# Altium project comm-rfb.PrjPcb
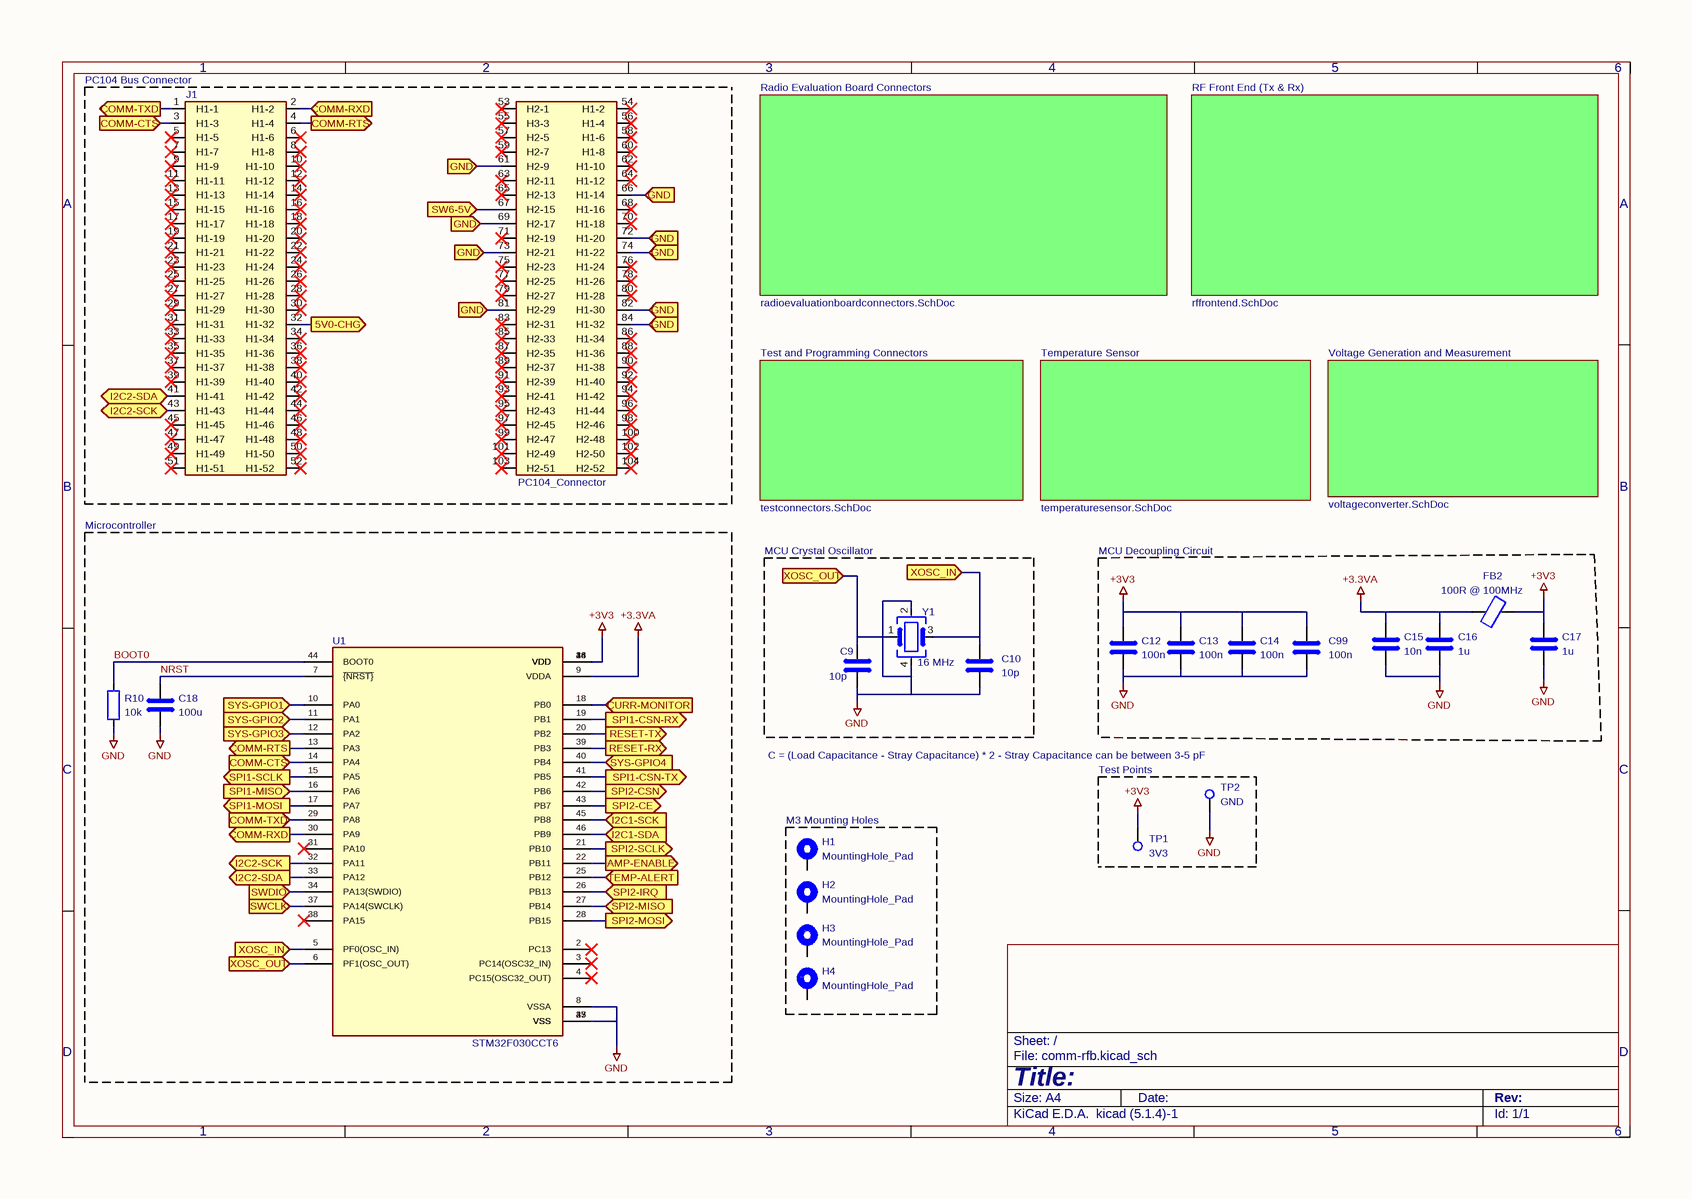
[diagram p0: comm-rfb.SchDoc]
14 sheets, 95 parts. Net scope: flat (ports and power ports of the same name join across sheets).
Board files: comm-rfb.PcbDoc, comm-rfb(1).PcbDoc
Sheets:
  comm-rfb.SchDoc
    Test and Programming Connectors = testconnectors.SchDoc
    RF Front End (Tx & Rx) = rffrontend.SchDoc
    Radio Evaluation Board Connectors = radioevaluationboardconnectors.SchDoc
    Voltage Generation and Measurement = voltageconverter.SchDoc
    Temperature Sensor = temperaturesensor.SchDoc
  currentandvoltagemeasure.SchDoc
  downlinkSMDConnector.SchDoc
  powerAMP.SchDoc
  programminginterface.SchDoc
  radiotestconnector.SchDoc
  SMAconnections.SchDoc
  systemtestconnector.SchDoc
  uplinkSMDConnector.SchDoc

## Sheet comm-rfb.SchDoc
size 297 x 209 mm

### Parts
(Parts that share a designator on the sheet are numbered #1, #2 ... from top to bottom, then left to right.)
C9  10p  [C_0603_1608Metric]
C10  10p  [C_0603_1608Metric]
C12  100n  [C_0603_1608Metric]
C13  100n  [C_0603_1608Metric]
C14  100n  [C_0603_1608Metric]
C15  10n  [C_0603_1608Metric]
C16  1u  [C_0603_1608Metric]
C17  1u  [C_0603_1608Metric]
C18  100u  [C_0603_1608Metric]
C99  100n  [C_0603_1608Metric]
FB2  100R @ 100MHz  [L_0603_1608Metric]
H1  MountingHole_Pad  [MountingHole_3.2mm_M3_Pad_TopBottom]
H2  MountingHole_Pad  [MountingHole_3.2mm_M3_Pad_TopBottom]
H3  MountingHole_Pad  [MountingHole_3.2mm_M3_Pad_TopBottom]
H4  MountingHole_Pad  [MountingHole_3.2mm_M3_Pad_TopBottom]
J1  PC104_Connector  [pc104-connector]
R10  10k  [R_0603_1608Metric]
TP1#1  3V3  [TestPoint_Pad_D2.0mm]
TP2  GND  [TestPoint_Pad_D2.0mm]
U1  STM32F030CCT6  [QFP50P900X900X160-48N]
Y1  16 MHz  [Crystal_SMD_3225-4Pin_3.2x2.5mm]

### Blocks framed on the sheet
PC104 Bus Connector: J1
Microcontroller: C18 R10 U1
MCU Crystal Oscillator: C9 C10 Y1
Test Points: TP1#1 TP2
M3 Mounting Holes /: H1-H4

### Sub-sheets
Radio Evaluation Board Connectors = radioevaluationboardconnectors.SchDoc: no entries
RF Front End (Tx & Rx) = rffrontend.SchDoc: no entries
Temperature Sensor = temperaturesensor.SchDoc: no entries
Test and Programming Connectors = testconnectors.SchDoc: no entries
Voltage Generation and Measurement = voltageconverter.SchDoc: no entries

### Ports
5V0-CHG (out), AMP-ENABLE (out), COMM-CTS (in), COMM-RTS (out), COMM-RXD (in), COMM-RXD (out), COMM-TXD (in), COMM-TXD (out), CURR-MONITOR (in), GND (in), I2C1-SCK (in), I2C1-SDA (in), I2C2-SCK (bidir), I2C2-SCK (out), I2C2-SDA (bidir), I2C2-SDA (out), RESET-RX (out), RESET-TX (out), SPI1-CSN-RX (out), SPI1-CSN-TX (out), SPI1-MISO (in), SPI1-MOSI (out), SPI1-SCLK (out), SPI2-CE (out), SPI2-CSN (out), SPI2-IRQ (in), SPI2-MISO (in), SPI2-MOSI (out), SPI2-SCLK (out), SW6-5V (in), SWCLK (in), SWDIO (in), SYS-GPIO1 (in), SYS-GPIO2 (in), SYS-GPIO3 (in), SYS-GPIO4 (in), TEMP-ALERT (in), XOSC_IN (in), XOSC_OUT (in)

### Nets
+3.3VA: C15.1 C16.1 FB2.1 U1.9(VDDA)
+3V3: C12.1 C13.1 C14.1 C17.1 C99.1 FB2.2 TP1#1.1 U1.1(VDD) U1.24(VDD) U1.36(VDD) U1.48(VDD)
GND: C9.2 C10.2 C12.2 C13.2 C14.2 C15.2 C16.2 C17.2 C18.2 C99.2 R10.2 TP2.1 U1.8(VSSA) U1.23(VSS) U1.35(VSS) U1.47(VSS) Y1.2 Y1.4
5V0-CHG: J1.32(H1-32) ; port 5V0-CHG
AMP-ENABLE: U1.22(PB11) ; port AMP-ENABLE
BOOT0: R10.1 U1.44(BOOT0)
COMM-CTS: J1.3(H1-3) U1.14(PA4) ; port COMM-CTS
COMM-RTS: J1.4(H1-4) U1.13(PA3) ; port COMM-RTS
COMM-RXD: J1.2(H1-2) U1.30(PA9) ; port COMM-RXD
COMM-TXD: J1.1(H1-1) U1.29(PA8) ; port COMM-TXD
CURR-MONITOR: U1.18(PB0) ; port CURR-MONITOR
GND: J1.61(H2-9) J1.66(H1-14) J1.69(H2-17) J1.72(H1-20) J1.73(H2-21) J1.74(H1-22) J1.81(H2-29) J1.82(H1-30) J1.84(H1-32) ; port GND  [a separate net that carries the same name]
I2C1-SCK: U1.45(PB8) ; port I2C1-SCK
I2C1-SDA: U1.46(PB9) ; port I2C1-SDA
I2C2-SCK: J1.43(H1-43) U1.32(PA11) ; port I2C2-SCK
I2C2-SDA: J1.41(H1-41) U1.33(PA12) ; port I2C2-SDA
NRST: C18.1 U1.7(~{{NRST}})
RESET-RX: U1.39(PB3) ; port RESET-RX
RESET-TX: U1.20(PB2) ; port RESET-TX
SPI1-CSN-RX: U1.19(PB1) ; port SPI1-CSN-RX
SPI1-CSN-TX: U1.41(PB5) ; port SPI1-CSN-TX
SPI1-MISO: U1.16(PA6) ; port SPI1-MISO
SPI1-MOSI: U1.17(PA7) ; port SPI1-MOSI
SPI1-SCLK: U1.15(PA5) ; port SPI1-SCLK
SPI2-CE: U1.43(PB7) ; port SPI2-CE
SPI2-CSN: U1.42(PB6) ; port SPI2-CSN
SPI2-IRQ: U1.26(PB13) ; port SPI2-IRQ
SPI2-MISO: U1.27(PB14) ; port SPI2-MISO
SPI2-MOSI: U1.28(PB15) ; port SPI2-MOSI
SPI2-SCLK: U1.21(PB10) ; port SPI2-SCLK
SW6-5V: J1.67(H2-15) ; port SW6-5V
SWCLK: U1.37(PA14(SWCLK)) ; port SWCLK
SWDIO: U1.34(PA13(SWDIO)) ; port SWDIO
SYS-GPIO1: U1.10(PA0) ; port SYS-GPIO1
SYS-GPIO2: U1.11(PA1) ; port SYS-GPIO2
SYS-GPIO3: U1.12(PA2) ; port SYS-GPIO3
SYS-GPIO4: U1.40(PB4) ; port SYS-GPIO4
TEMP-ALERT: U1.25(PB12) ; port TEMP-ALERT
XOSC_IN: C10.1 U1.5(PF0(OSC_IN)) Y1.3 ; port XOSC_IN
XOSC_OUT: C9.1 U1.6(PF1(OSC_OUT)) Y1.1 ; port XOSC_OUT

Not connected (* = marked no-connect by the designer): H1 1; H2 1; H3 1; H4 1; J1 5(H1-5)* 6(H1-6)* 7(H1-7)* 8(H1-8)* 9(H1-9)* 10(H1-10)* 11(H1-11)* 12(H1-12)* 13(H1-13)* 14(H1-14)* 15(H1-15)* 16(H1-16)* 17(H1-17)* 18(H1-18)* 19(H1-19)* 20(H1-20)* 21(H1-21)* 22(H1-22)* 23(H1-23)* 24(H1-24)* 25(H1-25)* 26(H1-26)* 27(H1-27)* 28(H1-28)* 29(H1-29)* 30(H1-30)* 31(H1-31)* 33(H1-33)* 34(H1-34)* 35(H1-35)* 36(H1-36)* 37(H1-37)* 38(H1-38)* 39(H1-39)* 40(H1-40)* 42(H1-42)* 44(H1-44)* 45(H1-45)* 46(H1-46)* 47(H1-47)* 48(H1-48)* 49(H1-49)* 50(H1-50)* 51(H1-51)* 52(H1-52)* 53(H2-1)* 54(H1-2)* 55(H3-3)* 56(H1-4)* 57(H2-5)* 58(H1-6)* 59(H2-7)* 60(H1-8)* 62(H1-10)* 63(H2-11)* 64(H1-12)* 65(H2-13)* 68(H1-16)* 70(H1-18)* 71(H2-19)* 75(H2-23)* 76(H1-24)* 77(H2-25)* 78(H1-26)* 79(H2-27)* 80(H1-28)* 83(H2-31)* 85(H2-33)* 86(H1-34)* 87(H2-35)* 88(H1-36)* 89(H2-37)* 90(H1-38)* 91(H2-39)* 92(H1-40)* 93(H2-41)* 94(H1-42)* 95(H2-43)* 96(H1-44)* 97(H2-45)* 98(H2-46)* 99(H2-47)* 100(H2-48)* 101(H2-49)* 102(H2-50)* 103(H2-51)* 104(H2-52)*; U1 2(PC13)* 3(PC14(OSC32_IN))* 4(PC15(OSC32_OUT))* 31(PA10)* 38(PA15)*

### Notes on the sheet
- MCU Decoupling Circuit
- (near TP2) C = (Load Capacitance - Stray Capacitance) * 2
  - Stray Capacitance can be between 3-5 pF
- 1
- 2
- 3
- 4
- 5
- 6
- A
- B
- C
- D
- Title:
- File: comm-rfb.kicad_sch
- Sheet: /
- KiCad E.D.A.  kicad (5.1.4)-1
- Size: A4
- Date:
- Rev:
- Id: 1/1

### Library data of the parts
C9 C10 C12-C18 C99 = C: Footprint: Capacitor_SMD:C_0603_1608Metric
  C9 C10: Value: 10p
  C12-C14 C99: Value: 100n
  C15: Value: 10n
  C16 C17: Value: 1u
  C18: Value: 100u
FB2 = FerriteBead: Value: 100R @ 100MHz; Footprint: Inductor_SMD:L_0603_1608Metric
R10 = R: Value: 10k; Footprint: Resistor_SMD:R_0603_1608Metric
TP1#1 TP2 = TestPoint: Footprint: TestPoint:TestPoint_Pad_D2.0mm
  TP1#1: Value: 3V3
  TP2: Value: GND
U1 = STM32F030CCT6: MANUFACTURER: STMicroelectronics; Value: STM32F030CCT6; Footprint: qset-footprints:QFP50P900X900X160-48N
Y1 = Crystal_GND24: Value: 16 MHz; Footprint: Crystal:Crystal_SMD_3225-4Pin_3.2x2.5mm
H1-H4 = MountingHole_Pad: Value: MountingHole_Pad; Footprint: MountingHole:MountingHole_3.2mm_M3_Pad_TopBottom
J1 = PC104_Connector: Value: PC104_Connector; Footprint: pc104-template:pc104-connector

## Sheet testconnectors.SchDoc
size 297 x 209 mm
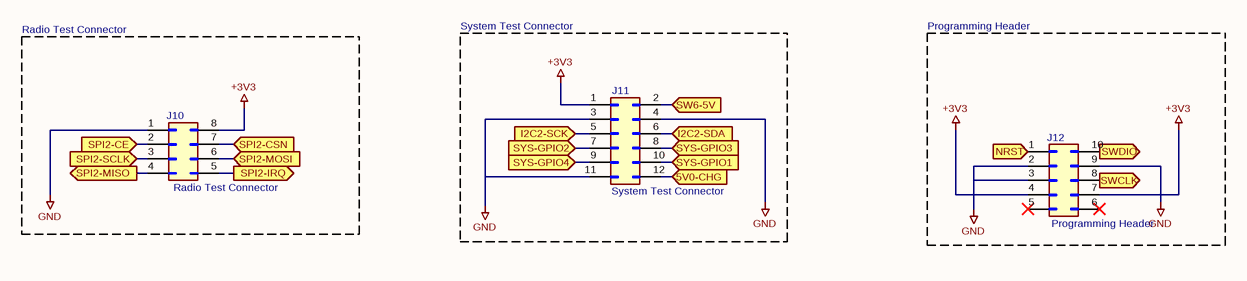
[diagram p1: testconnectors.SchDoc]

### Parts
(Parts that share a designator on the sheet are numbered #1, #2 ... from top to bottom, then left to right.)
J10#1  Radio Test Connector  [PinSocket_2x04_P2.54mm_Vertical]
J11#1  System Test Connector  [PinSocket_2x06_P2.54mm_Horizontal]
J12#1  Programming Header  [PinSocket_2x05_P2.54mm_Horizontal]

### Blocks framed on the sheet
Radio Test Connector: J10#1
System Test Connector: J11#1
Programming Header: J12#1

### Ports
5V0-CHG (in), I2C2-SCK (in), I2C2-SDA (in), NRST (in), SPI2-CE (in), SPI2-CSN (in), SPI2-IRQ (out), SPI2-MISO (out), SPI2-MOSI (in), SPI2-SCLK (in), SW6-5V (in), SWCLK (in), SWDIO (in), SYS-GPIO1 (in), SYS-GPIO2 (in), SYS-GPIO3 (in), SYS-GPIO4 (in)

### Nets
+3V3: J10#1.8(Pin_8) J11#1.1(Pin_1) J12#1.4(Pin_4) J12#1.7(Pin_7)
GND: J10#1.1(Pin_1) J11#1.3(Pin_3) J11#1.4(Pin_4) J11#1.11(Pin_11) J12#1.2(Pin_2) J12#1.3(Pin_3) J12#1.9(Pin_9)
5V0-CHG: J11#1.12(Pin_12) ; port 5V0-CHG
I2C2-SCK: J11#1.5(Pin_5) ; port I2C2-SCK
I2C2-SDA: J11#1.6(Pin_6) ; port I2C2-SDA
NRST: J12#1.1(Pin_1) ; port NRST
SPI2-CE: J10#1.2(Pin_2) ; port SPI2-CE
SPI2-CSN: J10#1.7(Pin_7) ; port SPI2-CSN
SPI2-IRQ: J10#1.5(Pin_5) ; port SPI2-IRQ
SPI2-MISO: J10#1.4(Pin_4) ; port SPI2-MISO
SPI2-MOSI: J10#1.6(Pin_6) ; port SPI2-MOSI
SPI2-SCLK: J10#1.3(Pin_3) ; port SPI2-SCLK
SW6-5V: J11#1.2(Pin_2) ; port SW6-5V
SWCLK: J12#1.8(Pin_8) ; port SWCLK
SWDIO: J12#1.10(Pin_10) ; port SWDIO
SYS-GPIO1: J11#1.10(Pin_10) ; port SYS-GPIO1
SYS-GPIO2: J11#1.7(Pin_7) ; port SYS-GPIO2
SYS-GPIO3: J11#1.8(Pin_8) ; port SYS-GPIO3
SYS-GPIO4: J11#1.9(Pin_9) ; port SYS-GPIO4

Not connected (* = marked no-connect by the designer): J12#1 5(Pin_5)* 6(Pin_6)*

### Notes on the sheet
- 1
- 2
- 3
- 4
- 5
- 6
- A
- B
- C
- D
- Title:
- File: testconnectors.kicad_sch
- Sheet: /
- KiCad E.D.A.  kicad (5.1.4)-1
- Size: A4
- Date:
- Rev:
- Id: 1/1

### Library data of the parts
J10#1 = Conn_02x04_Counter_Clockwise: Value: Radio Test Connector; Footprint: Connector_PinSocket_2.54mm:PinSocket_2x04_P2.54mm_Vertical
J11#1 = Conn_02x06_Odd_Even: Value: System Test Connector; Footprint: Connector_PinSocket_2.54mm:PinSocket_2x06_P2.54mm_Horizontal
J12#1 = Conn_02x05_Counter_Clockwise: Value: Programming Header; Footprint: Connector_PinSocket_2.54mm:PinSocket_2x05_P2.54mm_Horizontal

## Sheet rffrontend.SchDoc
size 297 x 209 mm
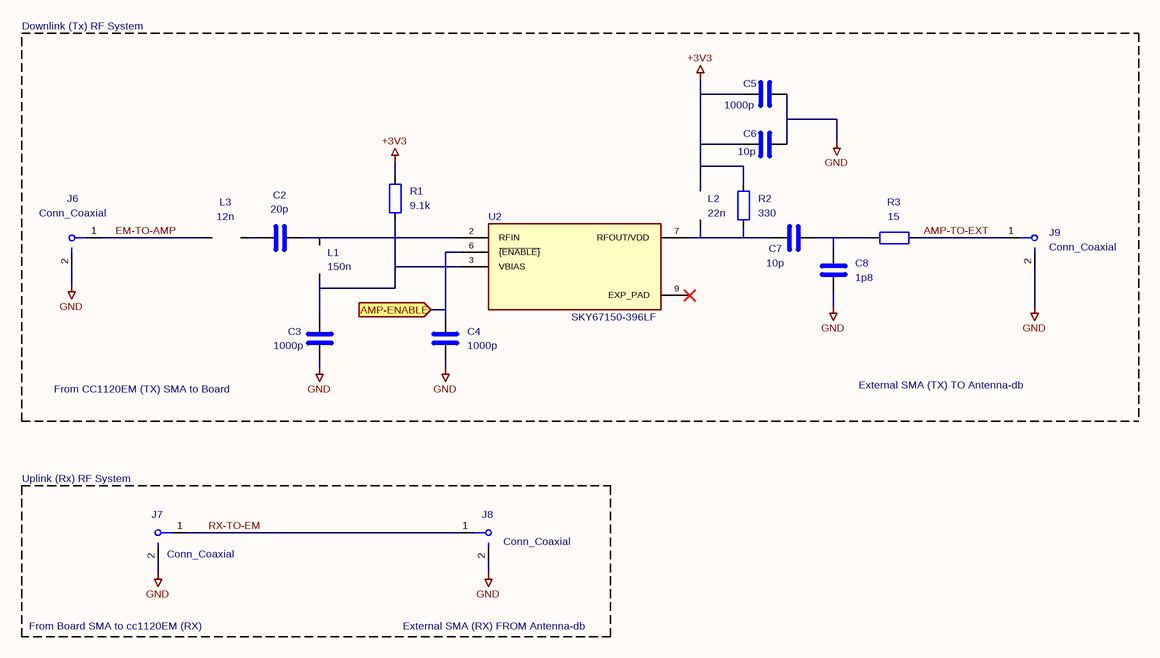
[diagram p2: rffrontend.SchDoc]

### Parts
(Parts that share a designator on the sheet are numbered #1, #2 ... from top to bottom, then left to right.)
C2#1  20p  [C_0402_1005Metric]
C3#1  1000p  [C_0402_1005Metric]
C4#1  1000p  [C_0402_1005Metric]
C5#1  1000p  [C_0402_1005Metric]
C6#1  10p  [C_0402_1005Metric]
C7#1  10p  [C_0402_1005Metric]
C8#1  1p8  [C_0402_1005Metric]
J6#1  Conn_Coaxial  [U.FL_Hirose_U.FL-R-SMT-1_Vertical]
J7#1  Conn_Coaxial  [U.FL_Hirose_U.FL-R-SMT-1_Vertical]
J8#1  Conn_Coaxial  [SMA_Amphenol_132134-11_Vertical]
J9#1  Conn_Coaxial  [SMA_Amphenol_132134-11_Vertical]
L1#1  150n  [L_0402_1005Metric]
L2#1  22n  [L_0402_1005Metric]
L3  12n  [L_0402_1005Metric]
R1#1  9.1k  [R_0603_1608Metric]
R2#1  330  [R_0402_1005Metric]
R3#1  15  [R_0402_1005Metric]
U2#1  SKY67150-396LF  [SON50P200X200X80-9N]

### Ports
AMP-ENABLE (in)

### Nets
+3V3: C5#1.1 C6#1.1 L2#1.1 R1#1.1 R2#1.1
GND: C3#1.2 C4#1.2 C5#1.2 C6#1.2 C8#1.2 J6#1.2(Ext) J7#1.2(Ext) J8#1.2(Ext) J9#1.2(Ext)
AMP-ENABLE: C4#1.1 U2#1.6(~{{ENABLE}}) ; port AMP-ENABLE
AMP-TO-EXT: J9#1.1(In) R3#1.2
EM-TO-AMP: J6#1.1(In) L3.1
RX-TO-EM: J7#1.1(In) J8#1.1(In)
NetC2#1_1: C2#1.1 L3.2
NetC2#1_2: C2#1.2 L1#1.1 U2#1.2(RFIN)
NetC3#1_1: C3#1.1 L1#1.2 R1#1.2 U2#1.3(VBIAS)
NetC7#1_1: C7#1.1 L2#1.2 R2#1.2 U2#1.7(RFOUT/VDD)
NetC7#1_2: C7#1.2 C8#1.1 R3#1.1

Not connected (* = marked no-connect by the designer): U2#1 9(EXP_PAD)*

### Notes on the sheet
- Downlink (Tx) RF System
- From CC1120EM (TX) SMA to Board
- External SMA (TX) TO Antenna-db
- (near J7#1) Uplink (Rx) RF System
- From Board SMA to cc1120EM (RX)
- External SMA (RX) FROM Antenna-db
- 1
- 2
- 3
- 4
- 5
- 6
- A
- B
- C
- D
- Title:
- File: rffrontend.kicad_sch
- Sheet: /
- KiCad E.D.A.  kicad (5.1.4)-1
- Size: A4
- Date:
- Rev:
- Id: 1/1

### Library data of the parts
C2#1 C3#1 C4#1 C5#1 C6#1 C7#1 C8#1 = C: Footprint: Capacitor_SMD:C_0402_1005Metric
  C2#1: Value: 20p
  C3#1 C4#1 C5#1: Value: 1000p
  C6#1 C7#1: Value: 10p
  C8#1: Value: 1p8
L1#1 L2#1 L3 = L: Footprint: Inductor_SMD:L_0402_1005Metric
  L1#1: Value: 150n
  L2#1: Value: 22n
  L3: Value: 12n
R1#1 R2#1 R3#1 = R
  R1#1: Value: 9.1k; Footprint: Resistor_SMD:R_0603_1608Metric
  R2#1: Value: 330; Footprint: Resistor_SMD:R_0402_1005Metric
  R3#1: Value: 15; Footprint: Resistor_SMD:R_0402_1005Metric
U2#1 = SKY67150-396LF: MANUFACTURER: Skyworks; SNAPEDA_PACKAE_ID: 8744; STANDARD: IPC-7351B; PARTREV: May 3,2017; Value: SKY67150-396LF
J6#1 J7#1 J8#1 J9#1 = Conn_Coaxial: Value: Conn_Coaxial
  J6#1 J7#1: Footprint: Connector_Coaxial:U.FL_Hirose_U.FL-R-SMT-1_Vertical
  J8#1 J9#1: Footprint: Connector_Coaxial:SMA_Amphenol_132134-11_Vertical

## Sheet radioevaluationboardconnectors.SchDoc
size 297 x 209 mm
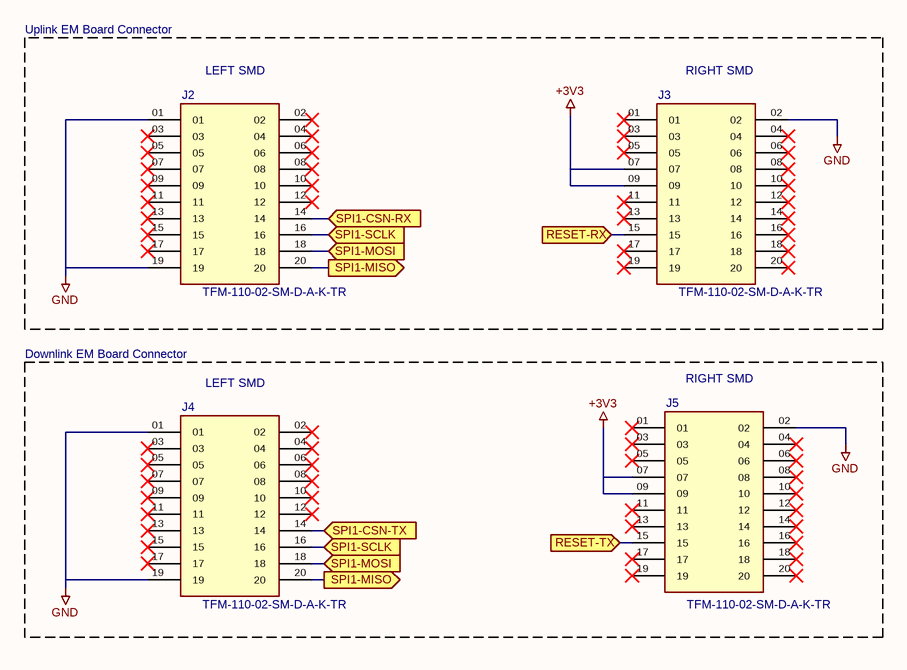
[diagram p3: radioevaluationboardconnectors.SchDoc]

### Parts
(Parts that share a designator on the sheet are numbered #1, #2 ... from top to bottom, then left to right.)
J2#1  TFM-110-02-SM-D-A-K-TR  [SAMTEC_TFM-110-02-SM-D-A-K-TR]
J3#1  TFM-110-02-SM-D-A-K-TR  [SAMTEC_TFM-110-02-SM-D-A-K-TR]
J4#1  TFM-110-02-SM-D-A-K-TR  [SAMTEC_TFM-110-02-SM-D-A-K-TR]
J5#1  TFM-110-02-SM-D-A-K-TR  [SAMTEC_TFM-110-02-SM-D-A-K-TR]

### Ports
RESET-RX (in), RESET-TX (in), SPI1-CSN-RX (in), SPI1-CSN-TX (in), SPI1-MISO (out), SPI1-MOSI (in), SPI1-SCLK (in)

### Nets
+3V3: J3#1.07 J3#1.09 J5#1.07 J5#1.09
GND: J2#1.01 J2#1.19 J3#1.02 J4#1.01 J4#1.19 J5#1.02
RESET-RX: J3#1.15 ; port RESET-RX
RESET-TX: J5#1.15 ; port RESET-TX
SPI1-CSN-RX: J2#1.14 ; port SPI1-CSN-RX
SPI1-CSN-TX: J4#1.14 ; port SPI1-CSN-TX
SPI1-MISO: J2#1.20 J4#1.20 ; port SPI1-MISO
SPI1-MOSI: J2#1.18 J4#1.18 ; port SPI1-MOSI
SPI1-SCLK: J2#1.16 J4#1.16 ; port SPI1-SCLK

Not connected (* = marked no-connect by the designer): J2#1 02* 03* 04* 05* 06* 07* 08* 09* 10* 11* 12* 13* 15* 17*; J3#1 01* 03* 04* 05* 06* 08* 10* 11* 12* 13* 14* 16* 17* 18* 19* 20*; J4#1 02* 03* 04* 05* 06* 07* 08* 09* 10* 11* 12* 13* 15* 17*; J5#1 01* 03* 04* 05* 06* 08* 10* 11* 12* 13* 14* 16* 17* 18* 19* 20*

### Notes on the sheet
- Uplink EM Board Connector
- (near J2#1) LEFT SMD
- (near J3#1) RIGHT SMD
- Downlink EM Board Connector
- (near J4#1) LEFT SMD
- (near J5#1) RIGHT SMD
- 1
- 2
- 3
- 4
- 5
- 6
- A
- B
- C
- D
- Title:
- File: radioevaluationboardconnectors.kicad_sch
- Sheet: /
- KiCad E.D.A.  kicad (5.1.4)-1
- Size: A4
- Date:
- Rev:
- Id: 1/1

### Library data of the parts
J2#1 J3#1 J4#1 J5#1 = TFM-110-02-SM-D-A-K-TR: MANUFACTURER: Samtec; STANDARD: Manufacturer Recommendations; PARTREV: R; Value: TFM-110-02-SM-D-A-K-TR

## Sheet voltageconverter.SchDoc
size 297 x 209 mm
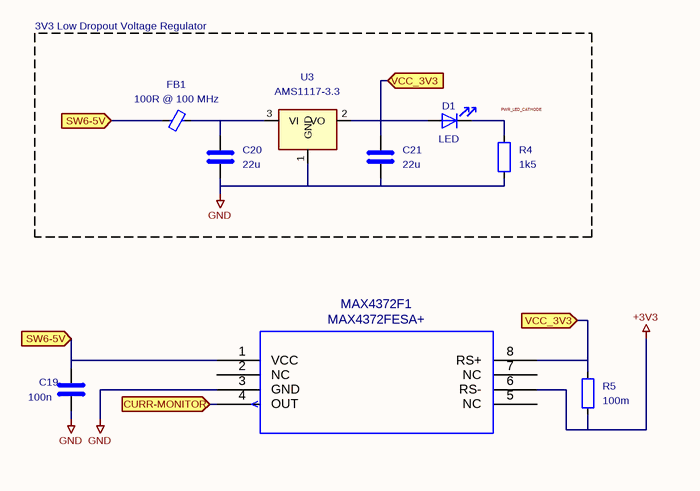
[diagram p4: voltageconverter.SchDoc]

### Parts
(Parts that share a designator on the sheet are numbered #1, #2 ... from top to bottom, then left to right.)
C19  100n  [C_0603_1608Metric]
C20  22u  [C_0603_1608Metric]
C21  22u  [C_0603_1608Metric]
D1  LED  [LED_0603_1608Metric]
FB1  100R @ 100 MHz  [L_0603_1608Metric]
MAX4372F1#1  MAX4372FESA+  [SOIC127P600X175-8N]
R4  1k5  [R_0603_1608Metric]
R5  100m  [R_0402_1005Metric]
U3  AMS1117-3.3  [SOT-223-3_TabPin2]

### Ports
CURR-MONITOR (in), SW6-5V (in), VCC_3V3 (in)

### Nets
+3V3: MAX4372F1#1.6(RS-) R5.2
GND: C19.2 C20.2 C21.2 MAX4372F1#1.3(GND) R4.1 U3.1(GND)
CURR-MONITOR: MAX4372F1#1.4(OUT) ; port CURR-MONITOR
SW6-5V: C19.1 FB1.2 MAX4372F1#1.1(VCC) ; port SW6-5V
VCC_3V3: C21.1 D1.2(A) MAX4372F1#1.8(RS+) R5.1 U3.2(VO) ; port VCC_3V3
NetC20_1: C20.1 FB1.1 U3.3(VI)
NetD1_1: D1.1(K) R4.2

Not connected (* = marked no-connect by the designer): MAX4372F1#1 2(NC) 5(NC) 7(NC)

### Notes on the sheet
- 3V3 Low Dropout Voltage Regulator
- Labels drawn without touching a wire or pin: PWR_LED_CATHODE
- 1
- 2
- 3
- 4
- 5
- 6
- A
- B
- C
- D
- Title:
- File: voltageconverter.kicad_sch
- Sheet: /
- KiCad E.D.A.  kicad (5.1.4)-1
- Size: A4
- Date:
- Rev:
- Id: 1/1

### Library data of the parts
C19-C21 = C: Footprint: Capacitor_SMD:C_0603_1608Metric
  C19: Value: 100n
  C20 C21: Value: 22u
FB1 = FerriteBead_Small: Value: 100R @ 100 MHz; Footprint: Inductor_SMD:L_0603_1608Metric
MAX4372F1#1 = MAX4372FESA+-MAX4372FESA+: Value: MAX4372FESA+; Footprint: STM32_Breakout:SOIC127P600X175-8N
R4 R5 = R
  R4: Value: 1k5; Footprint: Resistor_SMD:R_0603_1608Metric
  R5: Value: 100m; Footprint: Resistor_SMD:R_0402_1005Metric
D1 = LED: Value: LED; Footprint: LED_SMD:LED_0603_1608Metric
U3 = AMS1117-3.3: Value: AMS1117-3.3; Footprint: Package_TO_SOT_SMD:SOT-223-3_TabPin2

## Sheet temperaturesensor.SchDoc
size 297 x 209 mm
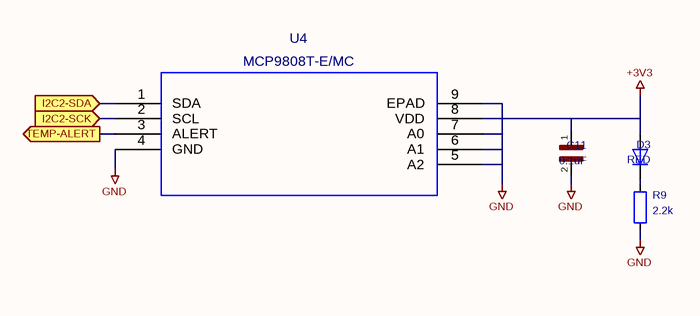
[diagram p5: temperaturesensor.SchDoc]

### Parts
C11  0.1uF  [C_0603_1608Metric]
D3  RED  [D_0603_1608Metric]
R9  2.2k  [R_0603_1608Metric]
U4  MCP9808T-E/MC  [MCP9808T-E&slash_MC]

### Ports
I2C2-SCK (in), I2C2-SDA (in), TEMP-ALERT (out)

### Nets
+3V3: C11.1 D3.1(A) U4.8(VDD)
GND: C11.2 R9.2 U4.4(GND) U4.5(A2) U4.6(A1) U4.7(A0) U4.9(EPAD)
I2C2-SCK: U4.2(SCL) ; port I2C2-SCK
I2C2-SDA: U4.1(SDA) ; port I2C2-SDA
TEMP-ALERT: U4.3(ALERT) ; port TEMP-ALERT
NetD3_2: D3.2(K) R9.1

### Notes on the sheet
- 1
- 2
- 3
- 4
- 5
- 6
- A
- B
- C
- D
- Title:
- File: temperaturesensor.kicad_sch
- Sheet: /
- KiCad E.D.A.  kicad (5.1.4)-1
- Size: A4
- Date:
- Rev:
- Id: 1/1

### Library data of the parts
C11 = CL10B104KB8NNNL: Value: 0.1uF; Footprint: Capacitor_SMD:C_0603_1608Metric
D3 = DIODE: Spice_Netlist_Enabled: Y; Spice_Primitive: D; Value: RED; Footprint: Diode_SMD:D_0603_1608Metric
R9 = R: Value: 2.2k; Footprint: Resistor_SMD:R_0603_1608Metric
U4 = MCP9808T-E{slash}MC: Value: MCP9808T-E/MC; Footprint: qset-footprints:MCP9808T-E&slash_MC

## Sheet currentandvoltagemeasure.SchDoc
size 297 x 209 mm
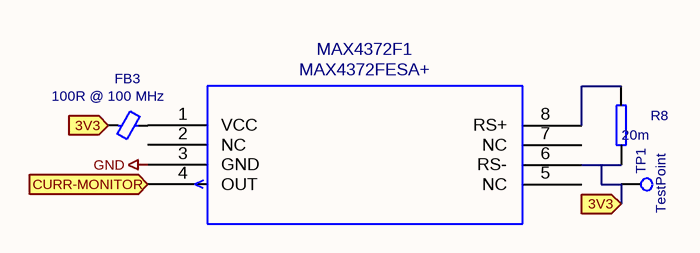
[diagram p6: currentandvoltagemeasure.SchDoc]

### Parts
(Parts that share a designator on the sheet are numbered #1, #2 ... from top to bottom, then left to right.)
FB3  100R @ 100 MHz  [INDUC1607X60N]
MAX4372F1#2  MAX4372FESA+  [SOIC127P600X175-8N]
R8  20m  [RESC1607X60N]
TP1#2  TestPoint  [TestPoint_Pad_D2.0mm]

### Ports
3V3 (in), CURR-MONITOR (in)

### Nets
GND: MAX4372F1#2.3(GND)
3V3: FB3.2 MAX4372F1#2.6(RS-) R8.2 TP1#2.1 ; port 3V3
CURR-MONITOR: MAX4372F1#2.4(OUT) ; port CURR-MONITOR
NetFB3_1: FB3.1 MAX4372F1#2.1(VCC)
NetMAX4372F1#2_8: MAX4372F1#2.8(RS+) R8.1

Not connected (* = marked no-connect by the designer): MAX4372F1#2 2(NC) 5(NC) 7(NC)

### Notes on the sheet
- 1
- 2
- 3
- 4
- 5
- 6
- A
- B
- C
- D
- Title:
- File: currentandvoltagemeasure.kicad_sch
- Sheet: /
- KiCad E.D.A.  kicad (5.1.4)-1
- Size: A4
- Date:
- Rev:
- Id: 1/1

### Library data of the parts
FB3 = Ferrite_Bead_Small: Value: 100R @ 100 MHz; Footprint: STM32_Breakout:INDUC1607X60N
MAX4372F1#2 = MAX4372FESA+-MAX4372FESA+: Value: MAX4372FESA+; Footprint: STM32_Breakout:SOIC127P600X175-8N
R8 = R0603-OBC_Libary: Value: 20m
TP1#2 = TestPoint: Value: TestPoint; Footprint: TestPoint:TestPoint_Pad_D2.0mm

## Sheet downlinkSMDConnector.SchDoc
size 297 x 209 mm
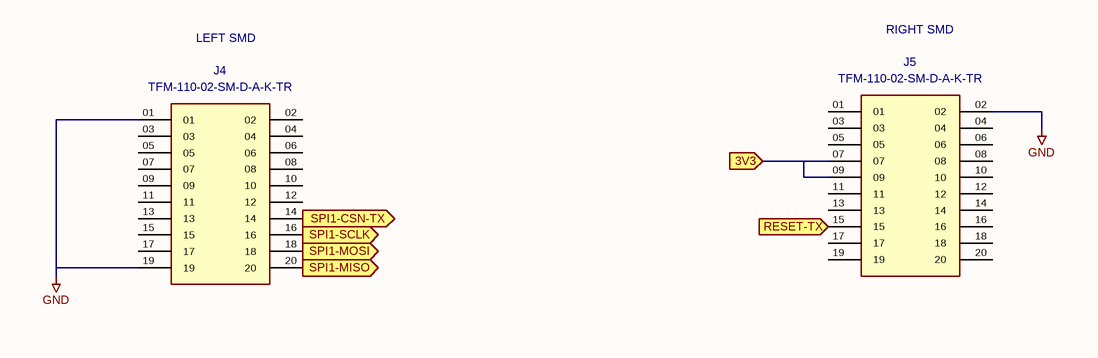
[diagram p7: downlinkSMDConnector.SchDoc]

### Parts
(Parts that share a designator on the sheet are numbered #1, #2 ... from top to bottom, then left to right.)
J4#2  TFM-110-02-SM-D-A-K-TR  [SAMTEC_TFM-110-02-SM-D-A-K-TR]
J5#2  TFM-110-02-SM-D-A-K-TR  [SAMTEC_TFM-110-02-SM-D-A-K-TR]

### Ports
3V3 (in), RESET-TX (in), SPI1-CSN-TX (in), SPI1-MISO (out), SPI1-MOSI (in), SPI1-SCLK (in)

### Nets
GND: J4#2.01 J4#2.19 J5#2.02
3V3: J5#2.07 J5#2.09 ; port 3V3
RESET-TX: J5#2.15 ; port RESET-TX
SPI1-CSN-TX: J4#2.14 ; port SPI1-CSN-TX
SPI1-MISO: J4#2.20 ; port SPI1-MISO
SPI1-MOSI: J4#2.18 ; port SPI1-MOSI
SPI1-SCLK: J4#2.16 ; port SPI1-SCLK

Not connected (* = marked no-connect by the designer): J4#2 02 03 04 05 06 07 08 09 10 11 12 13 15 17; J5#2 01 03 04 05 06 08 10 11 12 13 14 16 17 18 19 20

### Notes on the sheet
- LEFT SMD
- RIGHT SMD
- 1
- 2
- 3
- 4
- 5
- 6
- A
- B
- C
- D
- Title:
- File: downlinkSMDConnector.kicad_sch
- Sheet: /
- KiCad E.D.A.  kicad (5.1.4)-1
- Size: A4
- Date:
- Rev:
- Id: 1/1

### Library data of the parts
J4#2 J5#2 = TFM-110-02-SM-D-A-K-TR: MANUFACTURER: Samtec; STANDARD: Manufacturer Recommendations; PARTREV: R; Value: TFM-110-02-SM-D-A-K-TR

## Sheet powerAMP.SchDoc
size 297 x 209 mm
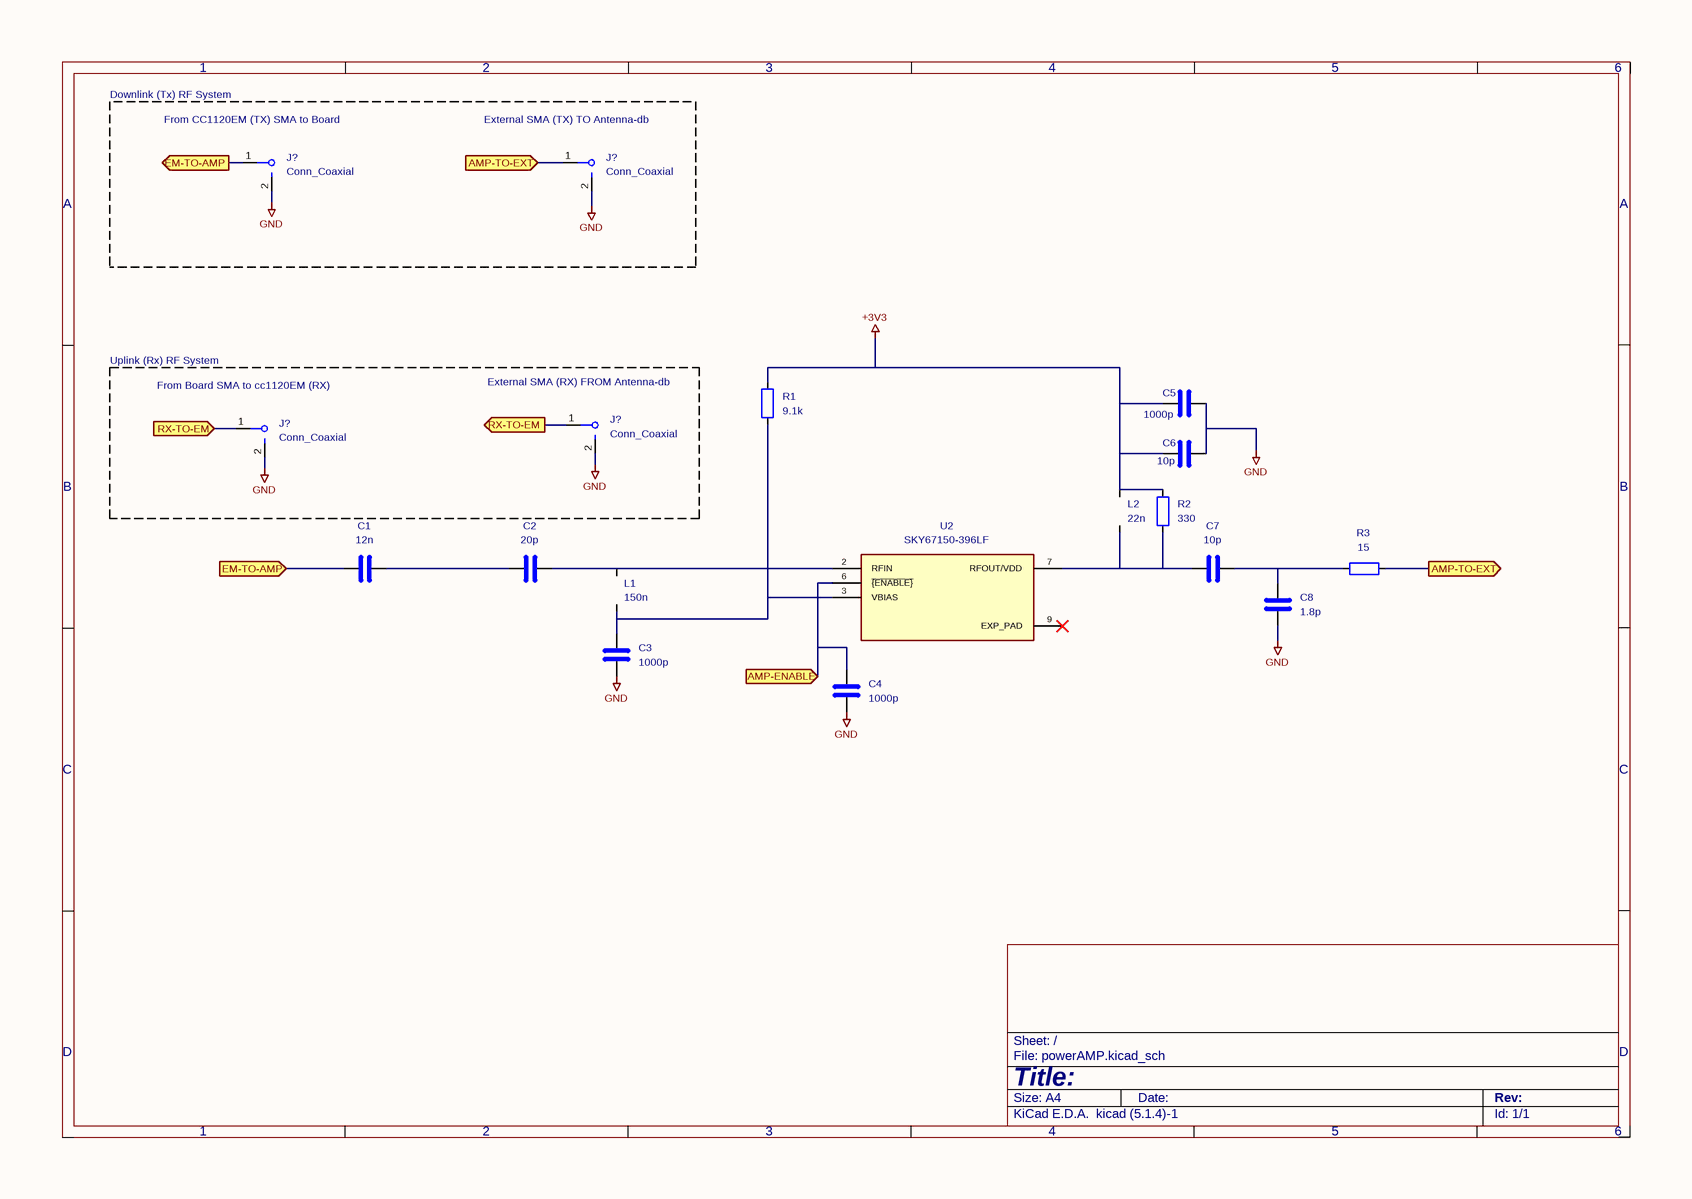
[diagram p8: powerAMP.SchDoc]

### Parts
(Parts that share a designator on the sheet are numbered #1, #2 ... from top to bottom, then left to right.)
C1  12n
C2#2  20p
C3#2  1000p
C4#2  1000p
C5#2  1000p
C6#2  10p
C7#2  10p
C8#2  1.8p
J?#1  Conn_Coaxial  [SMA_Amphenol_132134-10_Vertical]
J?#2  Conn_Coaxial  [SMA_Amphenol_132134-10_Vertical]
J?#3  Conn_Coaxial  [SMA_Amphenol_132134-10_Vertical]
J?#4  Conn_Coaxial  [SMA_Amphenol_132134-10_Vertical]
L1#2  150n
L2#2  22n
R1#2  9.1k
R2#2  330
R3#2  15
U2#2  SKY67150-396LF  [SON50P200X200X80-9N]

### Ports
AMP-ENABLE (in), AMP-TO-EXT (in), AMP-TO-EXT (out), EM-TO-AMP (in), EM-TO-AMP (out), RX-TO-EM (in), RX-TO-EM (out)

### Nets
+3V3: C5#2.1 C6#2.1 L2#2.1 R1#2.1 R2#2.1
GND: C3#2.2 C4#2.2 C5#2.2 C6#2.2 C8#2.2 J?#1.2(Ext) J?#2.2(Ext) J?#3.2(Ext) J?#4.2(Ext)
AMP-ENABLE: C4#2.1 U2#2.6(~{{ENABLE}}) ; port AMP-ENABLE
AMP-TO-EXT: J?#2.1(In) R3#2.2 ; port AMP-TO-EXT
EM-TO-AMP: C1.2 J?#1.1(In) ; port EM-TO-AMP
RX-TO-EM: J?#3.1(In) J?#4.1(In) ; port RX-TO-EM
NetC1_1: C1.1 C2#2.1
NetC2#2_2: C2#2.2 L1#2.1 U2#2.2(RFIN)
NetC3#2_1: C3#2.1 L1#2.2 R1#2.2 U2#2.3(VBIAS)
NetC7#2_1: C7#2.1 L2#2.2 R2#2.2 U2#2.7(RFOUT/VDD)
NetC7#2_2: C7#2.2 C8#2.1 R3#2.1

Not connected (* = marked no-connect by the designer): U2#2 9(EXP_PAD)*

### Notes on the sheet
- Downlink (Tx) RF System
- (near J?#1) From CC1120EM (TX) SMA to Board
- (near J?#2) External SMA (TX) TO Antenna-db
- Uplink (Rx) RF System
- (near J?#4) From Board SMA to cc1120EM (RX)
- (near J?#3) External SMA (RX) FROM Antenna-db
- 1
- 2
- 3
- 4
- 5
- 6
- A
- B
- C
- D
- Title:
- File: powerAMP.kicad_sch
- Sheet: /
- KiCad E.D.A.  kicad (5.1.4)-1
- Size: A4
- Date:
- Rev:
- Id: 1/1

### Library data of the parts
C1 C2#2 C3#2 C4#2 C5#2 C6#2 C7#2 C8#2 = C
  C1: Value: 12n
  C2#2: Value: 20p
  C3#2 C4#2 C5#2: Value: 1000p
  C6#2 C7#2: Value: 10p
  C8#2: Value: 1.8p
L1#2 L2#2 = L
  L1#2: Value: 150n
  L2#2: Value: 22n
R1#2 R2#2 R3#2 = R
  R1#2: Value: 9.1k
  R2#2: Value: 330
  R3#2: Value: 15
U2#2 = SKY67150-396LF: as U2#1 on sheet rffrontend; STANDARD: IPC-7351B; PARTREV: May 3,2017; Value: SKY67150-396LF
J?#1-J?#4 = Conn_Coaxial: Value: Conn_Coaxial; Footprint: Connector_Coaxial:SMA_Amphenol_132134-10_Vertical

## Sheet programminginterface.SchDoc
size 297 x 209 mm

### Notes on the sheet
- 1
- 2
- 3
- 4
- 5
- 6
- A
- B
- C
- D
- Title:
- File: programminginterface.kicad_sch
- Sheet: /
- KiCad E.D.A.  kicad (5.1.4)-1
- Size: A4
- Date:
- Rev:
- Id: 1/1

## Sheet radiotestconnector.SchDoc
size 297 x 209 mm
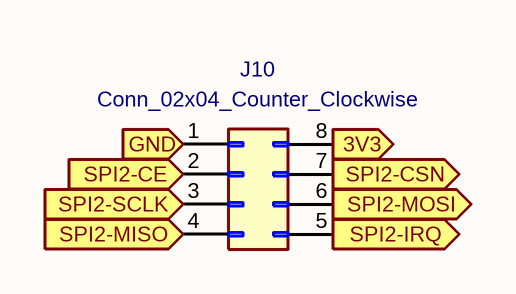
[diagram p9: radiotestconnector.SchDoc]

### Parts
(Parts that share a designator on the sheet are numbered #1, #2 ... from top to bottom, then left to right.)
J10#2  Conn_02x04_Counter_Clockwise

### Ports
3V3 (in), GND (in), SPI2-CE (in), SPI2-CSN (in), SPI2-IRQ (out), SPI2-MISO (out), SPI2-MOSI (in), SPI2-SCLK (in)

### Nets
3V3: J10#2.8(Pin_8) ; port 3V3
GND: J10#2.1(Pin_1) ; port GND
SPI2-CE: J10#2.2(Pin_2) ; port SPI2-CE
SPI2-CSN: J10#2.7(Pin_7) ; port SPI2-CSN
SPI2-IRQ: J10#2.5(Pin_5) ; port SPI2-IRQ
SPI2-MISO: J10#2.4(Pin_4) ; port SPI2-MISO
SPI2-MOSI: J10#2.6(Pin_6) ; port SPI2-MOSI
SPI2-SCLK: J10#2.3(Pin_3) ; port SPI2-SCLK

### Notes on the sheet
- 1
- 2
- 3
- 4
- 5
- 6
- A
- B
- C
- D
- Title:
- File: radiotestconnector.kicad_sch
- Sheet: /
- KiCad E.D.A.  kicad (5.1.4)-1
- Size: A4
- Date:
- Rev:
- Id: 1/1

### Library data of the parts
J10#2 = Conn_02x04_Counter_Clockwise: Value: Conn_02x04_Counter_Clockwise

## Sheet SMAconnections.SchDoc
size 297 x 209 mm
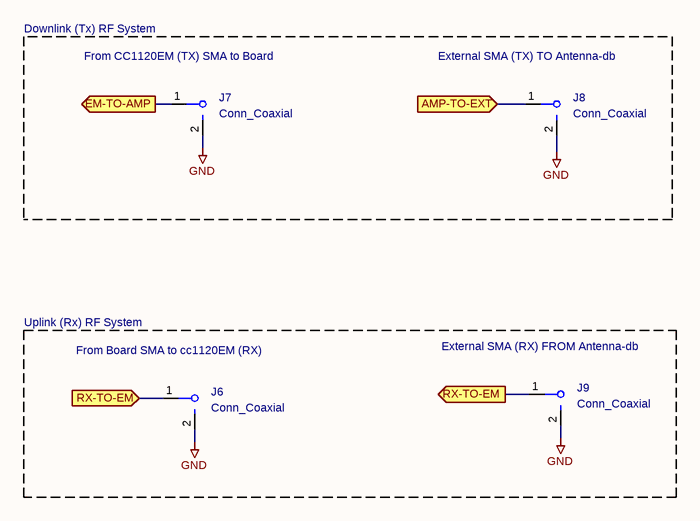
[diagram p10: SMAconnections.SchDoc]

### Parts
(Parts that share a designator on the sheet are numbered #1, #2 ... from top to bottom, then left to right.)
J6#2  Conn_Coaxial  [SMA_Amphenol_132134-10_Vertical]
J7#2  Conn_Coaxial  [SMA_Amphenol_132134-10_Vertical]
J8#2  Conn_Coaxial  [SMA_Amphenol_132134-10_Vertical]
J9#2  Conn_Coaxial  [SMA_Amphenol_132134-10_Vertical]

### Ports
AMP-TO-EXT (in), EM-TO-AMP (out), RX-TO-EM (in), RX-TO-EM (out)

### Nets
GND: J6#2.2(Ext) J7#2.2(Ext) J8#2.2(Ext) J9#2.2(Ext)
AMP-TO-EXT: J8#2.1(In) ; port AMP-TO-EXT
EM-TO-AMP: J7#2.1(In) ; port EM-TO-AMP
RX-TO-EM: J6#2.1(In) J9#2.1(In) ; port RX-TO-EM

### Notes on the sheet
- Downlink (Tx) RF System
- (near J7#2) From CC1120EM (TX) SMA to Board
- (near J8#2) External SMA (TX) TO Antenna-db
- Uplink (Rx) RF System
- (near J6#2) From Board SMA to cc1120EM (RX)
- (near J9#2) External SMA (RX) FROM Antenna-db
- 1
- 2
- 3
- 4
- 5
- 6
- A
- B
- C
- D
- Title:
- File: SMAconnections.kicad_sch
- Sheet: /
- KiCad E.D.A.  kicad (5.1.4)-1
- Size: A4
- Date:
- Rev:
- Id: 1/1

### Library data of the parts
J6#2 J7#2 J8#2 J9#2 = Conn_Coaxial: Value: Conn_Coaxial; Footprint: Connector_Coaxial:SMA_Amphenol_132134-10_Vertical

## Sheet systemtestconnector.SchDoc
size 297 x 209 mm
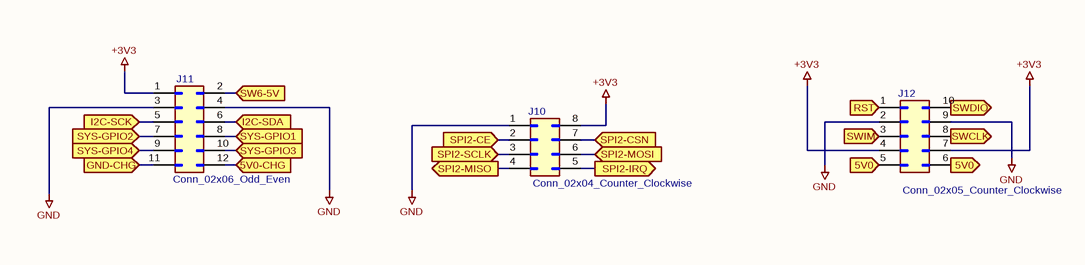
[diagram p11: systemtestconnector.SchDoc]

### Parts
(Parts that share a designator on the sheet are numbered #1, #2 ... from top to bottom, then left to right.)
J10#3  Conn_02x04_Counter_Clockwise
J11#2  Conn_02x06_Odd_Even
J12#2  Conn_02x05_Counter_Clockwise

### Ports
5V0 (in), 5V0-CHG (in), GND-CHG (in), I2C-SCK (in), I2C-SDA (in), RST (out), SPI2-CE (in), SPI2-CSN (in), SPI2-IRQ (out), SPI2-MISO (out), SPI2-MOSI (in), SPI2-SCLK (in), SW6-5V (in), SWCLK (out), SWDIO (out), SWIM (out), SYS-GPIO1 (in), SYS-GPIO2 (in), SYS-GPIO3 (in), SYS-GPIO4 (in)

### Nets
+3V3: J10#3.8(Pin_8) J11#2.1(Pin_1) J12#2.4(Pin_4) J12#2.7(Pin_7)
GND: J10#3.1(Pin_1) J11#2.3(Pin_3) J11#2.4(Pin_4) J12#2.2(Pin_2) J12#2.9(Pin_9)
5V0: J12#2.5(Pin_5) J12#2.6(Pin_6) ; port 5V0
5V0-CHG: J11#2.12(Pin_12) ; port 5V0-CHG
GND-CHG: J11#2.11(Pin_11) ; port GND-CHG
I2C-SCK: J11#2.5(Pin_5) ; port I2C-SCK
I2C-SDA: J11#2.6(Pin_6) ; port I2C-SDA
RST: J12#2.1(Pin_1) ; port RST
SPI2-CE: J10#3.2(Pin_2) ; port SPI2-CE
SPI2-CSN: J10#3.7(Pin_7) ; port SPI2-CSN
SPI2-IRQ: J10#3.5(Pin_5) ; port SPI2-IRQ
SPI2-MISO: J10#3.4(Pin_4) ; port SPI2-MISO
SPI2-MOSI: J10#3.6(Pin_6) ; port SPI2-MOSI
SPI2-SCLK: J10#3.3(Pin_3) ; port SPI2-SCLK
SW6-5V: J11#2.2(Pin_2) ; port SW6-5V
SWCLK: J12#2.8(Pin_8) ; port SWCLK
SWDIO: J12#2.10(Pin_10) ; port SWDIO
SWIM: J12#2.3(Pin_3) ; port SWIM
SYS-GPIO1: J11#2.8(Pin_8) ; port SYS-GPIO1
SYS-GPIO2: J11#2.7(Pin_7) ; port SYS-GPIO2
SYS-GPIO3: J11#2.10(Pin_10) ; port SYS-GPIO3
SYS-GPIO4: J11#2.9(Pin_9) ; port SYS-GPIO4

### Notes on the sheet
- 1
- 2
- 3
- 4
- 5
- 6
- A
- B
- C
- D
- Title:
- File: systemtestconnector.kicad_sch
- Sheet: /
- KiCad E.D.A.  kicad (5.1.4)-1
- Size: A4
- Date:
- Rev:
- Id: 1/1

### Library data of the parts
J10#3 = Conn_02x04_Counter_Clockwise: Value: Conn_02x04_Counter_Clockwise
J11#2 = Conn_02x06_Odd_Even: Value: Conn_02x06_Odd_Even
J12#2 = Conn_02x05_Counter_Clockwise: Value: Conn_02x05_Counter_Clockwise

## Sheet uplinkSMDConnector.SchDoc
size 297 x 209 mm
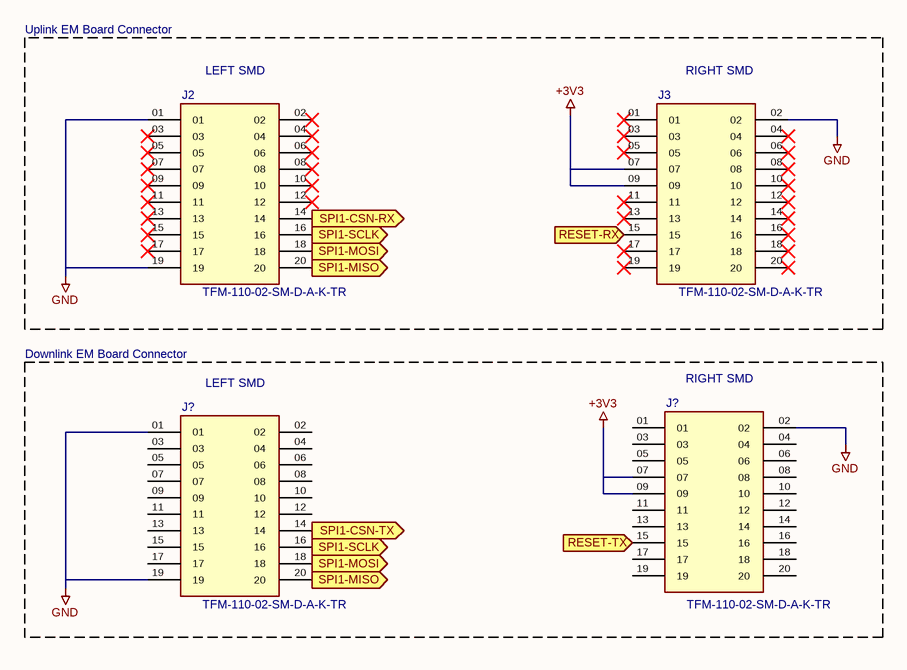
[diagram p12: uplinkSMDConnector.SchDoc]

### Parts
(Parts that share a designator on the sheet are numbered #1, #2 ... from top to bottom, then left to right.)
J2#2  TFM-110-02-SM-D-A-K-TR  [SAMTEC_TFM-110-02-SM-D-A-K-TR]
J3#2  TFM-110-02-SM-D-A-K-TR  [SAMTEC_TFM-110-02-SM-D-A-K-TR]
J?#5  TFM-110-02-SM-D-A-K-TR  [SAMTEC_TFM-110-02-SM-D-A-K-TR]
J?#6  TFM-110-02-SM-D-A-K-TR  [SAMTEC_TFM-110-02-SM-D-A-K-TR]

### Ports
RESET-RX (in), RESET-TX (in), SPI1-CSN-RX (in), SPI1-CSN-TX (in), SPI1-MISO (out), SPI1-MOSI (in), SPI1-SCLK (in)

### Nets
+3V3: J3#2.07 J3#2.09 J?#5.07 J?#5.09
GND: J2#2.01 J2#2.19 J3#2.02 J?#5.02 J?#6.01 J?#6.19
RESET-RX: J3#2.15 ; port RESET-RX
RESET-TX: J?#5.15 ; port RESET-TX
SPI1-CSN-RX: J2#2.14 ; port SPI1-CSN-RX
SPI1-CSN-TX: J?#6.14 ; port SPI1-CSN-TX
SPI1-MISO: J2#2.20 J?#6.20 ; port SPI1-MISO
SPI1-MOSI: J2#2.18 J?#6.18 ; port SPI1-MOSI
SPI1-SCLK: J2#2.16 J?#6.16 ; port SPI1-SCLK

Not connected (* = marked no-connect by the designer): J2#2 02* 03* 04* 05* 06* 07* 08* 09* 10* 11* 12* 13* 15* 17*; J3#2 01* 03* 04* 05* 06* 08* 10* 11* 12* 13* 14* 16* 17* 18* 19* 20*; J?#5 01 03 04 05 06 08 10 11 12 13 14 16 17 18 19 20; J?#6 02 03 04 05 06 07 08 09 10 11 12 13 15 17

### Notes on the sheet
- Uplink EM Board Connector
- (near J2#2) LEFT SMD
- (near J3#2) RIGHT SMD
- Downlink EM Board Connector
- (near J?#6) LEFT SMD
- (near J?#5) RIGHT SMD
- 1
- 2
- 3
- 4
- 5
- 6
- A
- B
- C
- D
- Title:
- File: uplinkSMDConnector.kicad_sch
- Sheet: /
- KiCad E.D.A.  kicad (5.1.4)-1
- Size: A4
- Date:
- Rev:
- Id: 1/1

### Library data of the parts
J2#2 J3#2 J?#5 J?#6 = TFM-110-02-SM-D-A-K-TR: MANUFACTURER: Samtec; STANDARD: Manufacturer Recommendations; PARTREV: R; Value: TFM-110-02-SM-D-A-K-TR

## Nets that join several sheets
+3V3: comm-rfb (11 pins), testconnectors (J10#1.8 J11#1.1 J12#1.4 J12#1.7), rffrontend (5 pins), radioevaluationboardconnectors (J3#1.07 J3#1.09 J5#1.07 J5#1.09), voltageconverter (MAX4372F1#1.6 R5.2), temperaturesensor (C11.1 D3.1 U4.8), powerAMP (5 pins), systemtestconnector (J10#3.8 J11#2.1 J12#2.4 J12#2.7), uplinkSMDConnector (J3#2.07 J3#2.09 J?#5.07 J?#5.09)
GND: comm-rfb (18 pins), testconnectors (7 pins), rffrontend (9 pins), radioevaluationboardconnectors (6 pins), voltageconverter (6 pins), temperaturesensor (7 pins), currentandvoltagemeasure (MAX4372F1#2.3), downlinkSMDConnector (J4#2.01 J4#2.19 J5#2.02), powerAMP (9 pins), SMAconnections (J6#2.2 J7#2.2 J8#2.2 J9#2.2), systemtestconnector (5 pins), uplinkSMDConnector (6 pins)
3V3: currentandvoltagemeasure (FB3.2 MAX4372F1#2.6 R8.2 TP1#2.1), downlinkSMDConnector (J5#2.07 J5#2.09), radiotestconnector (J10#2.8)
5V0-CHG: comm-rfb (J1.32), testconnectors (J11#1.12), systemtestconnector (J11#2.12)
AMP-ENABLE: comm-rfb (U1.22), rffrontend (C4#1.1 U2#1.6), powerAMP (C4#2.1 U2#2.6)
AMP-TO-EXT: powerAMP (J?#2.1 R3#2.2), SMAconnections (J8#2.1)
CURR-MONITOR: comm-rfb (U1.18), voltageconverter (MAX4372F1#1.4), currentandvoltagemeasure (MAX4372F1#2.4)
EM-TO-AMP: powerAMP (C1.2 J?#1.1), SMAconnections (J7#2.1)
GND: comm-rfb (9 pins), radiotestconnector (J10#2.1)
I2C2-SCK: comm-rfb (J1.43 U1.32), testconnectors (J11#1.5), temperaturesensor (U4.2)
I2C2-SDA: comm-rfb (J1.41 U1.33), testconnectors (J11#1.6), temperaturesensor (U4.1)
RESET-RX: comm-rfb (U1.39), radioevaluationboardconnectors (J3#1.15), uplinkSMDConnector (J3#2.15)
RESET-TX: comm-rfb (U1.20), radioevaluationboardconnectors (J5#1.15), downlinkSMDConnector (J5#2.15), uplinkSMDConnector (J?#5.15)
RX-TO-EM: powerAMP (J?#3.1 J?#4.1), SMAconnections (J6#2.1 J9#2.1)
SPI1-CSN-RX: comm-rfb (U1.19), radioevaluationboardconnectors (J2#1.14), uplinkSMDConnector (J2#2.14)
SPI1-CSN-TX: comm-rfb (U1.41), radioevaluationboardconnectors (J4#1.14), downlinkSMDConnector (J4#2.14), uplinkSMDConnector (J?#6.14)
SPI1-MISO: comm-rfb (U1.16), radioevaluationboardconnectors (J2#1.20 J4#1.20), downlinkSMDConnector (J4#2.20), uplinkSMDConnector (J2#2.20 J?#6.20)
SPI1-MOSI: comm-rfb (U1.17), radioevaluationboardconnectors (J2#1.18 J4#1.18), downlinkSMDConnector (J4#2.18), uplinkSMDConnector (J2#2.18 J?#6.18)
SPI1-SCLK: comm-rfb (U1.15), radioevaluationboardconnectors (J2#1.16 J4#1.16), downlinkSMDConnector (J4#2.16), uplinkSMDConnector (J2#2.16 J?#6.16)
SPI2-CE: comm-rfb (U1.43), testconnectors (J10#1.2), radiotestconnector (J10#2.2), systemtestconnector (J10#3.2)
SPI2-CSN: comm-rfb (U1.42), testconnectors (J10#1.7), radiotestconnector (J10#2.7), systemtestconnector (J10#3.7)
SPI2-IRQ: comm-rfb (U1.26), testconnectors (J10#1.5), radiotestconnector (J10#2.5), systemtestconnector (J10#3.5)
SPI2-MISO: comm-rfb (U1.27), testconnectors (J10#1.4), radiotestconnector (J10#2.4), systemtestconnector (J10#3.4)
SPI2-MOSI: comm-rfb (U1.28), testconnectors (J10#1.6), radiotestconnector (J10#2.6), systemtestconnector (J10#3.6)
SPI2-SCLK: comm-rfb (U1.21), testconnectors (J10#1.3), radiotestconnector (J10#2.3), systemtestconnector (J10#3.3)
SW6-5V: comm-rfb (J1.67), testconnectors (J11#1.2), voltageconverter (C19.1 FB1.2 MAX4372F1#1.1), systemtestconnector (J11#2.2)
SWCLK: comm-rfb (U1.37), testconnectors (J12#1.8), systemtestconnector (J12#2.8)
SWDIO: comm-rfb (U1.34), testconnectors (J12#1.10), systemtestconnector (J12#2.10)
SYS-GPIO1: comm-rfb (U1.10), testconnectors (J11#1.10), systemtestconnector (J11#2.8)
SYS-GPIO2: comm-rfb (U1.11), testconnectors (J11#1.7), systemtestconnector (J11#2.7)
SYS-GPIO3: comm-rfb (U1.12), testconnectors (J11#1.8), systemtestconnector (J11#2.10)
SYS-GPIO4: comm-rfb (U1.40), testconnectors (J11#1.9), systemtestconnector (J11#2.9)
TEMP-ALERT: comm-rfb (U1.25), temperaturesensor (U4.3)